# EasyEDA Pro project ProPrj_Business Card Macro Pad_2025-06-18.epro, schematic Business Card Macro Pad

## Sheets
1 MCU: Board Name: Board1; Create Date: 2025-04-06; Page Name: MCU; Project Name: Business Card Macro Pad; Schematic Name: Business Card Macro Pad; Update Date: 2025-04-10; Company: JFHCA; Drawn: Jaron O'Grady; Page Size: A3; Version: V1.0
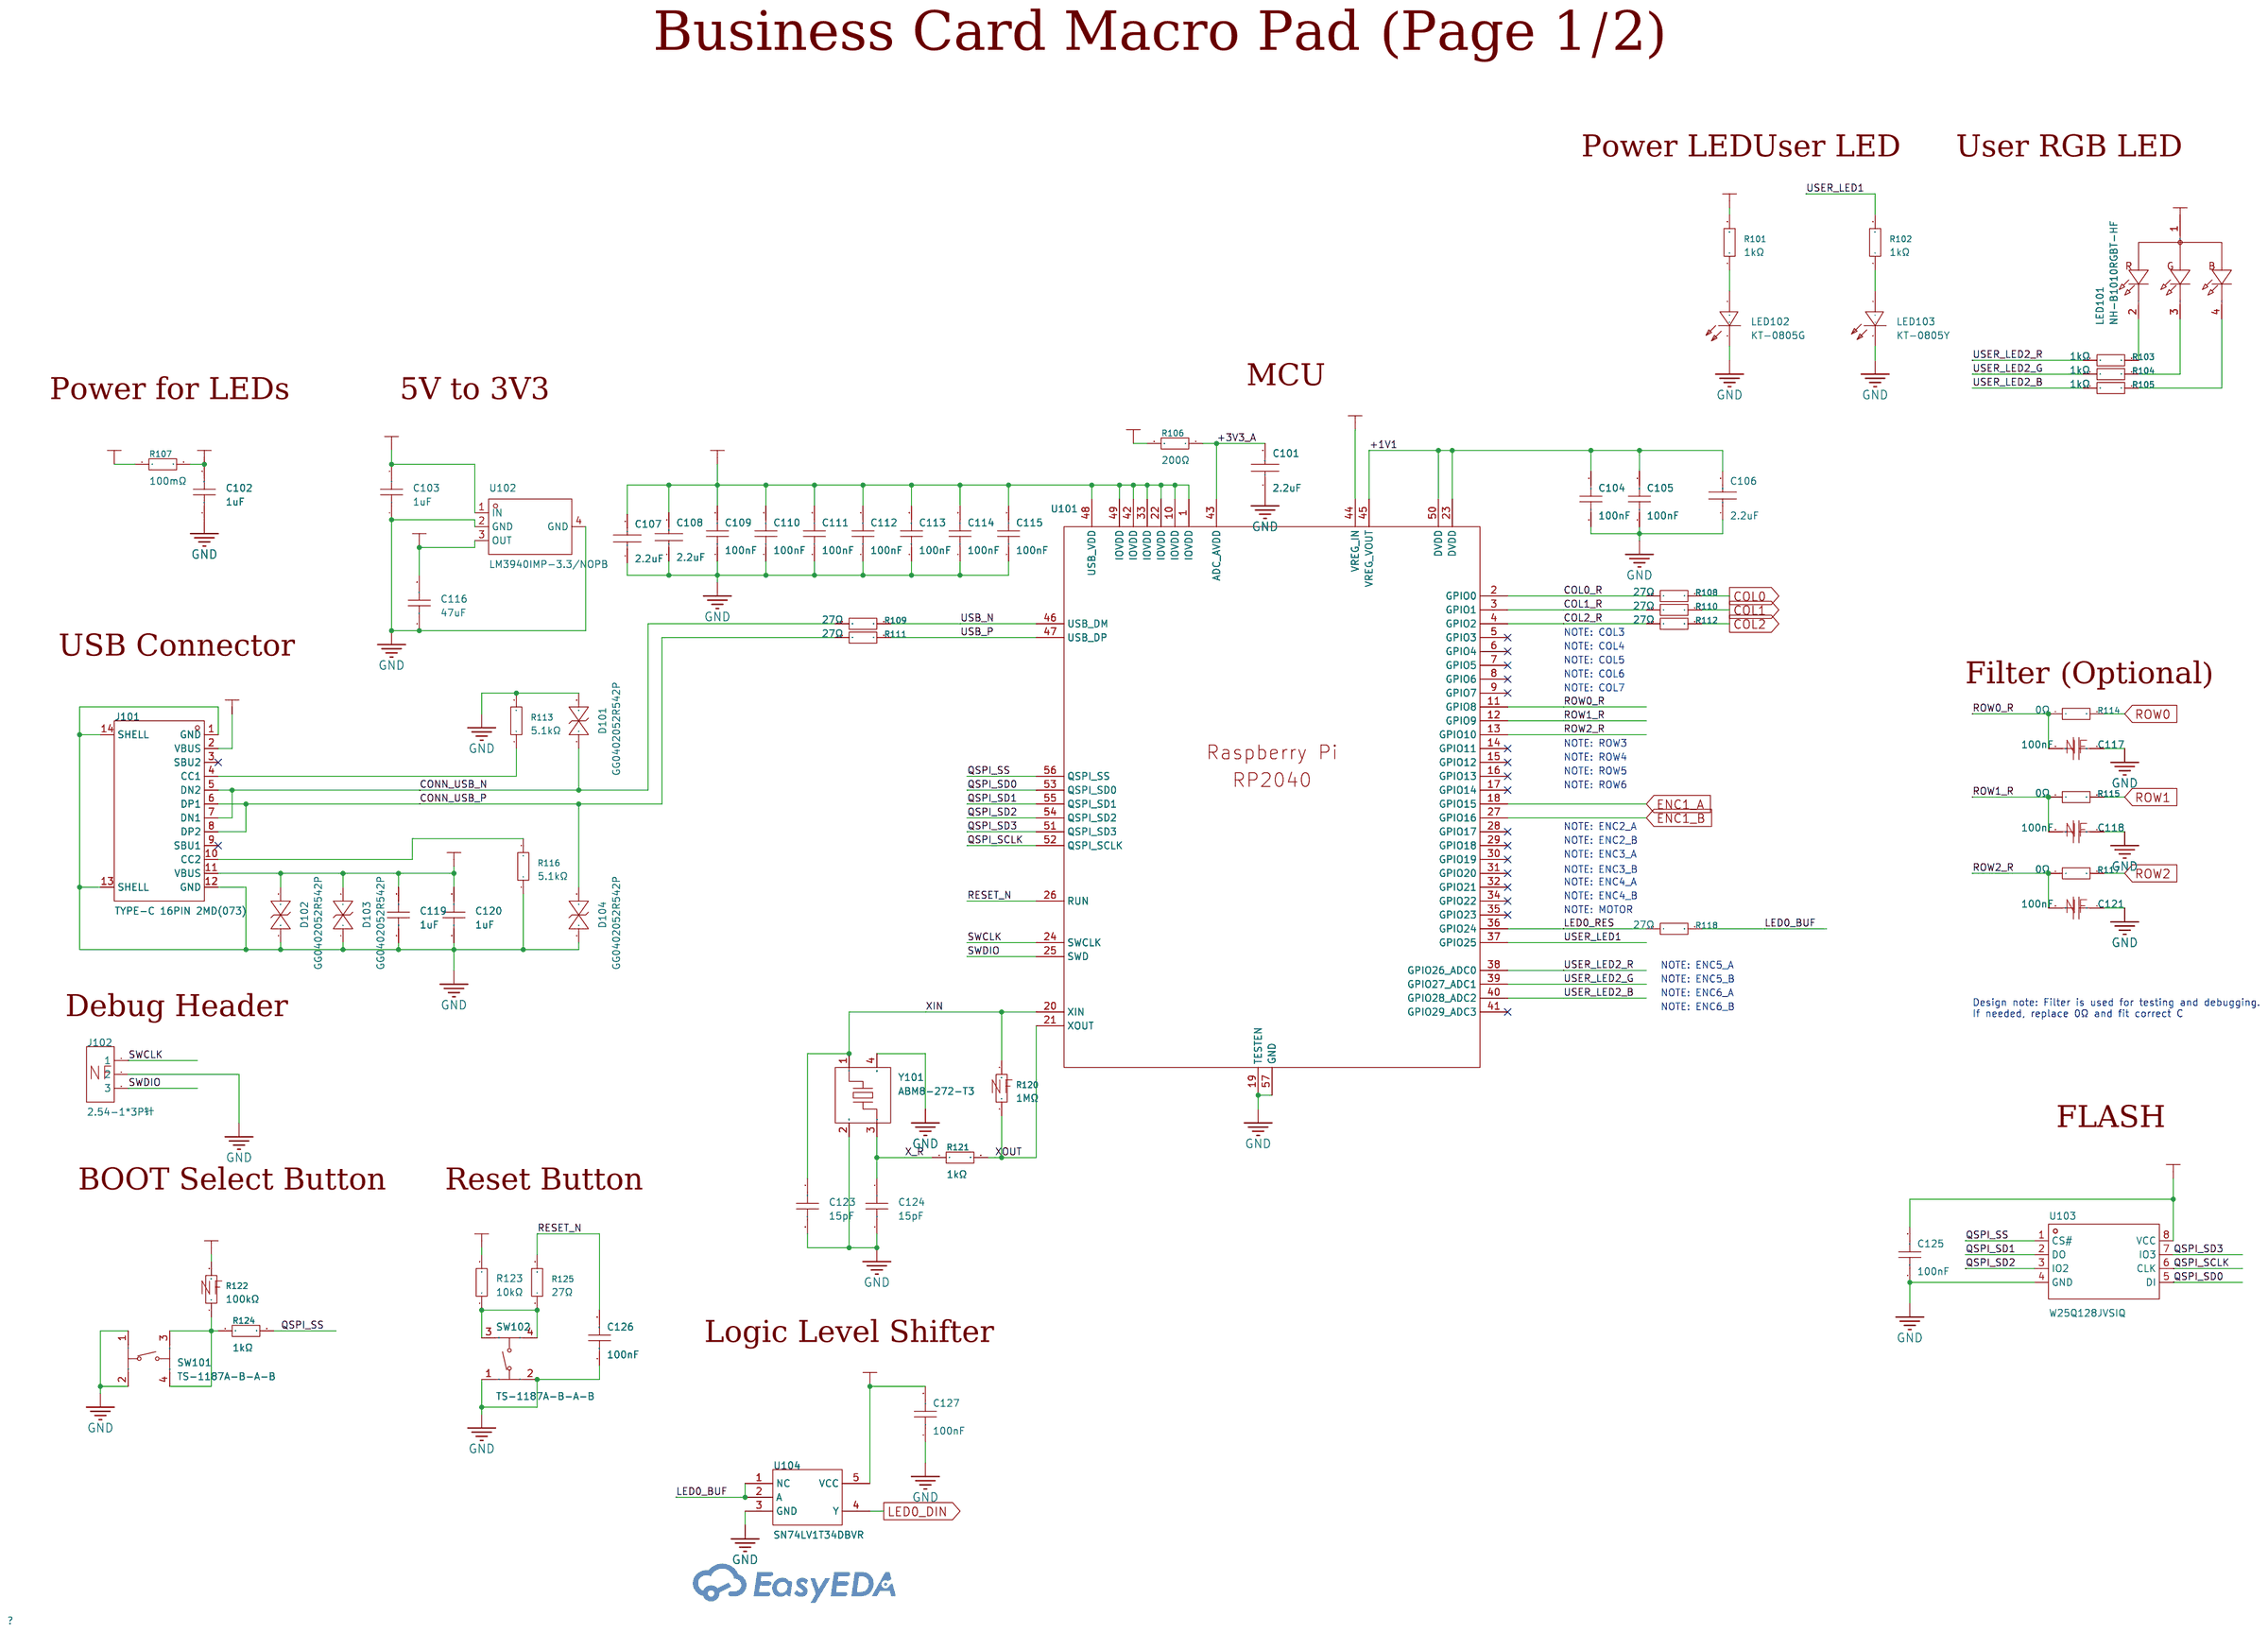
[diagram p0: MCU]
2 OTHER: Page Name: OTHER; Update Date: 2025-04-11
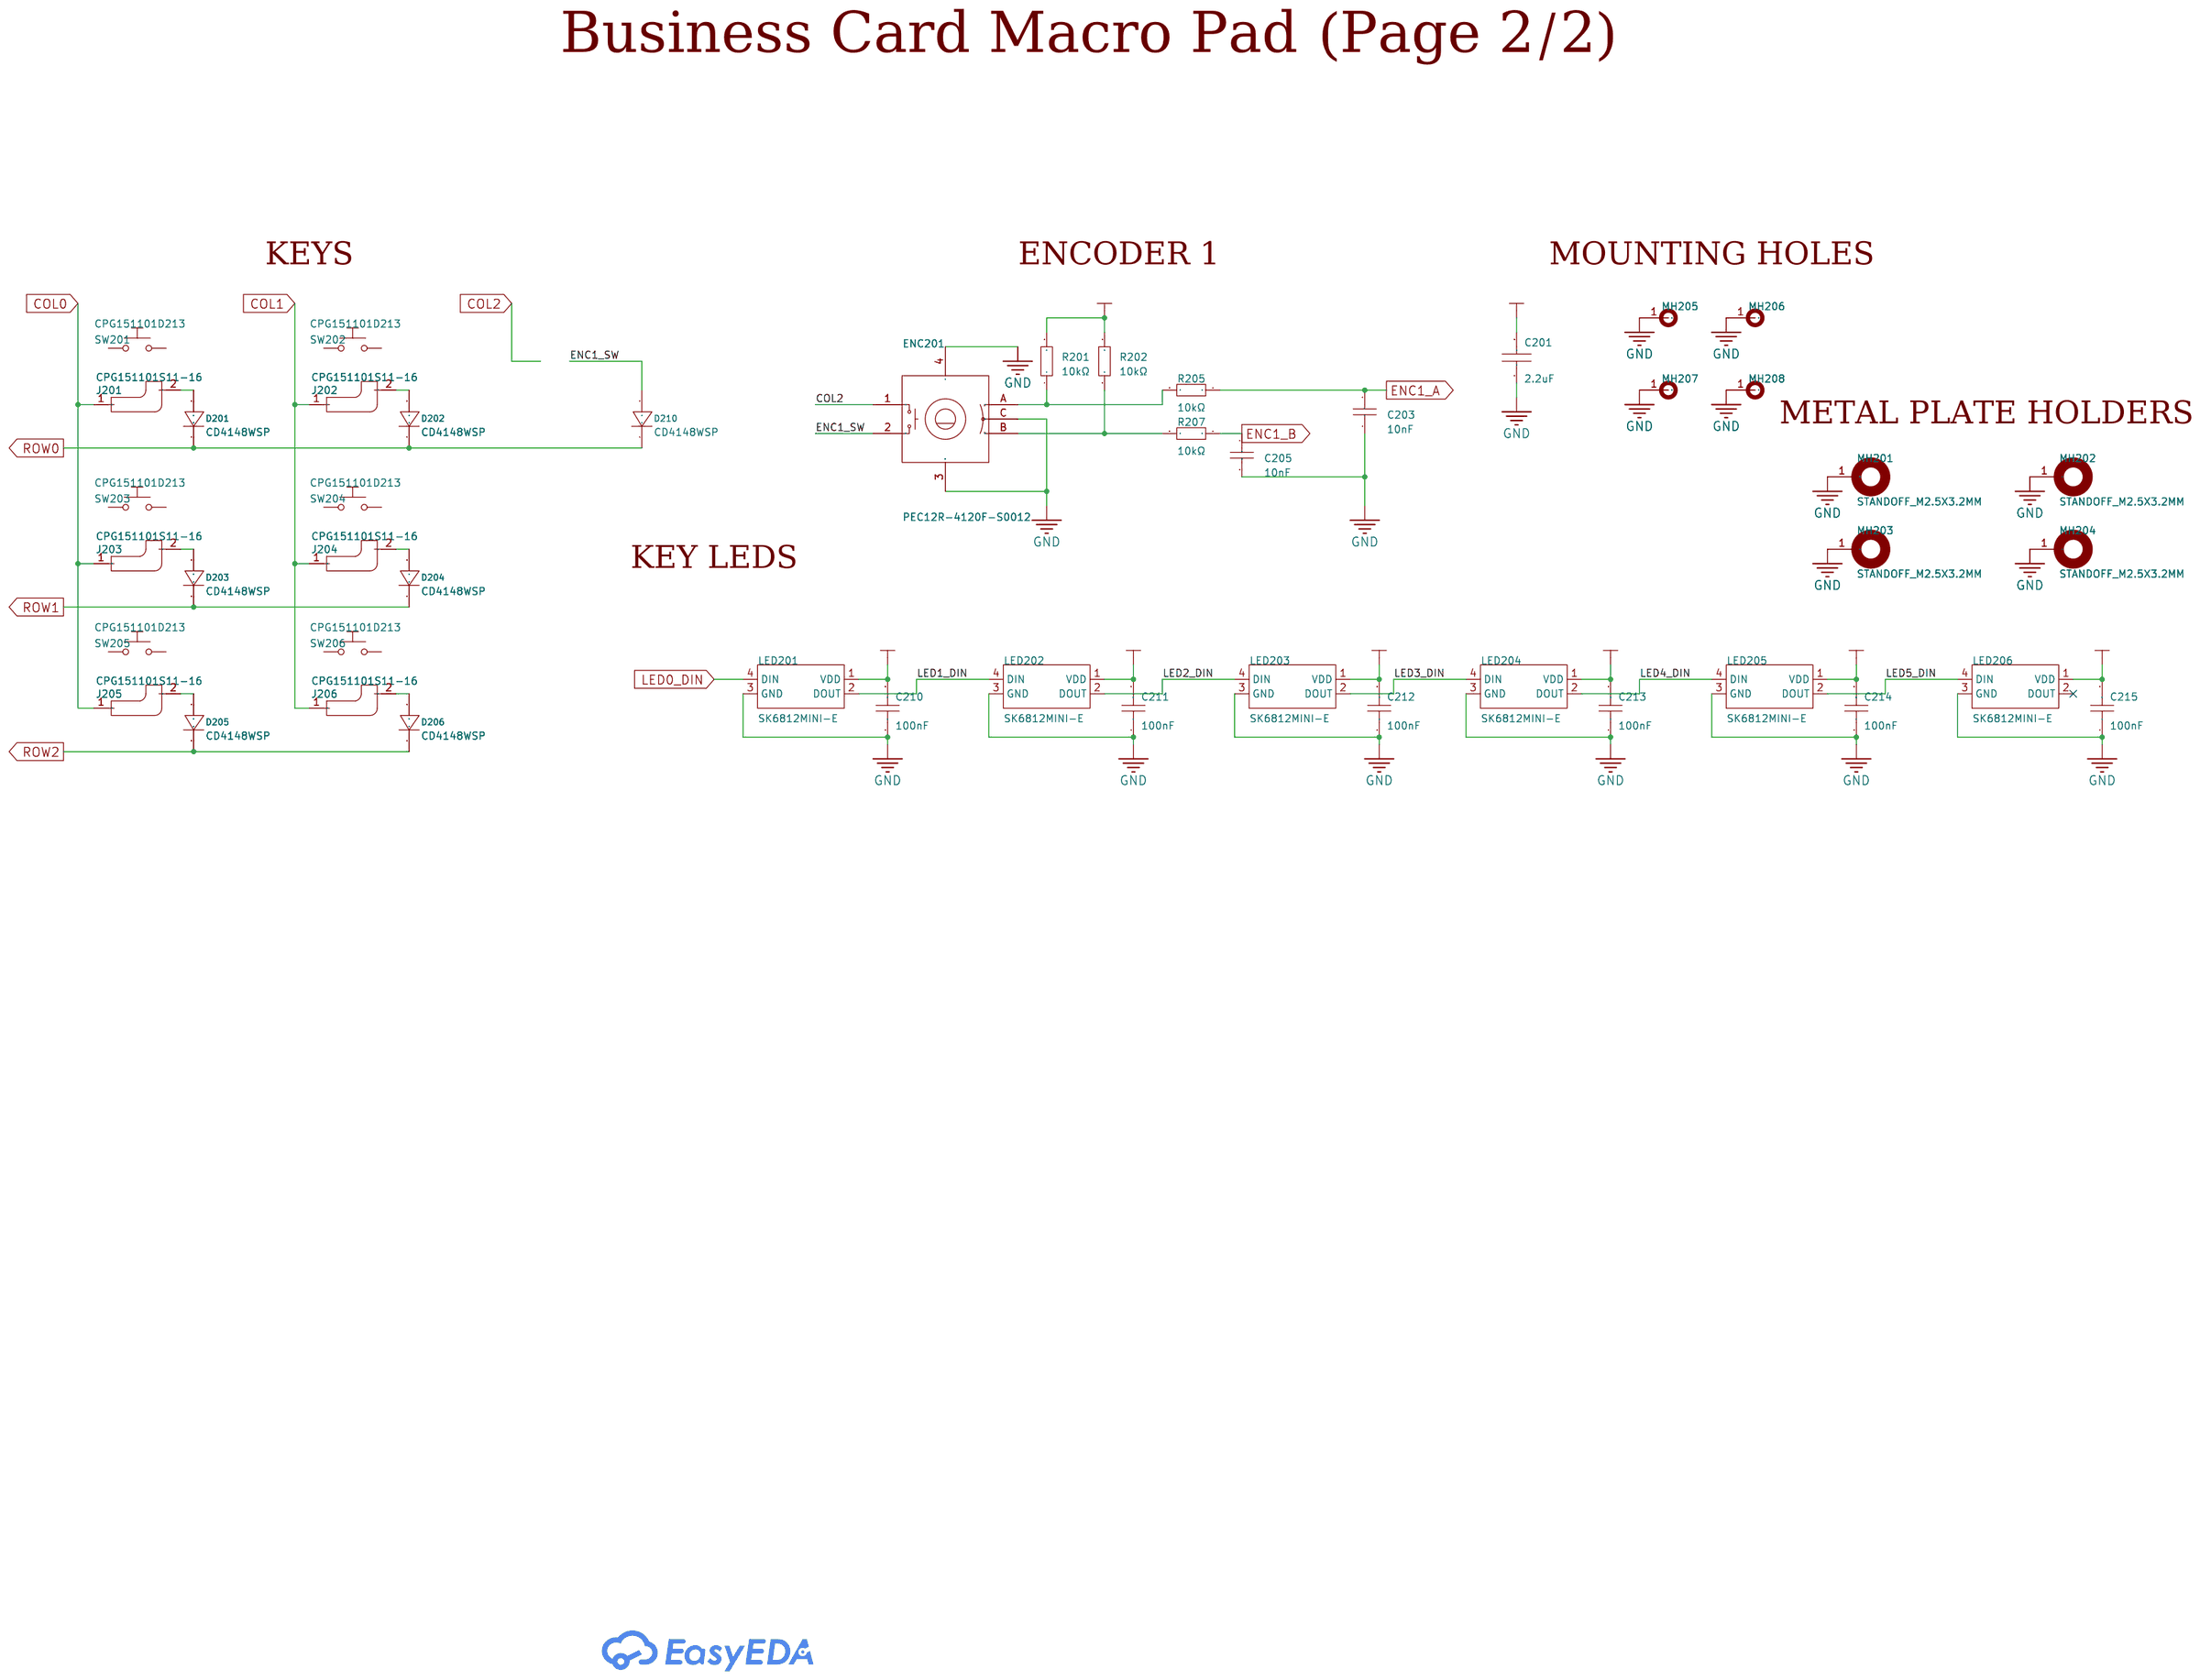
[diagram p1: OTHER]

## Parts
sheet MCU
C101  2.2uF  [C0402]
C102  1uF  [C0402]
C103  1uF  [C0402]
C104  100nF  [C0402]
C105  100nF  [C0402]
C106  2.2uF  [C0402]
C107  2.2uF  [C0402]
C108  2.2uF  [C0402]
C109  100nF  [C0402]
C110  100nF  [C0402]
C111  100nF  [C0402]
C112  100nF  [C0402]
C113  100nF  [C0402]
C114  100nF  [C0402]
C115  100nF  [C0402]
C116  47uF  [C1206]
C117  100nF  [C0402]  (no BOM)
C118  100nF  [C0402]  (no BOM)
C119  1uF  [C0402]
C120  1uF  [C0402]
C121  100nF  [C0402]  (no BOM)
C123  15pF  [C0402]
C124  15pF  [C0402]
C125  100nF  [C0402]
C126  100nF  [C0402]
C127  100nF  [C0402]
D101  GG0402052R542P  [D0402-BI]
D102  GG0402052R542P  [D0402-BI]
D103  GG0402052R542P  [D0402-BI]
D104  GG0402052R542P  [D0402-BI]
J101  TYPE-C 16PIN 2MD(073)  [USB-C-SMD_TYPE-C-6PIN-2MD-073]
J102  2.54-1*3P针  [HDR-TH_3P-P2.54-V-M-1]  (no BOM)
LED101  NH-B1010RGBT-HF  [LED-ARRAY-SMD_4P-L1.0-W1.0-TR_NH-B1010RGBT]
LED102  KT-0805G  [LED0805-R-RD]
LED103  KT-0805Y  [LED0805-R-RD]
R101  1kΩ  [R0402]
R102  1kΩ  [R0402]
R103  1kΩ  [R0402]
R104  1kΩ  [R0402]
R105  1kΩ  [R0402]
R106  200Ω  [R0402]
R107  100mΩ  [R1206]
R108  27Ω  [R0402]
R109  27Ω  [R0402]
R110  27Ω  [R0402]
R111  27Ω  [R0402]
R112  27Ω  [R0402]
R113  5.1kΩ  [R0402]
R114  0Ω  [R0402]
R115  0Ω  [R0402]
R116  5.1kΩ  [R0402]
R117  0Ω  [R0402]
R118  27Ω  [R0402]
R120  1MΩ  [R0402]  (no BOM)
R121  1kΩ  [R0402]
R122  100kΩ  [R0402]  (no BOM)
R123  10kΩ  [R0402]
R124  1kΩ  [R0402]
R125  27Ω  [R0402]
SW101  TS-1187A-B-A-B  [SW-SMD_4P-L5.1-W5.1-P3.70-LS6.5-TL_H1.5]
SW102  TS-1187A-B-A-B  [SW-SMD_4P-L5.1-W5.1-P3.70-LS6.5-TL_H1.5]
U101  RP2040  [LQFN-56_L7.0-W7.0-P0.4-EP]
U102  LM3940IMP-3.3/NOPB  [SOT-223_L6.5-W3.5-P2.30-LS7.0-BR]
U103  W25Q128JVSIQ  [SOIC-8_L5.3-W5.3-P1.27-LS8.0-BL]
U104  SN74LV1T34DBVR  [SOT-23-5_L2.9-W1.6-P0.95-LS2.8-BR]
Y101  ABM8-272-T3  [CRYSTAL-SMD_4P-L3.2-W2.5-BL]
sheet OTHER
C201  2.2uF  [C0402]
C203  10nF  [C0402]
C205  10nF  [C0402]
C210  100nF  [C0402]
C211  100nF  [C0402]
C212  100nF  [C0402]
C213  100nF  [C0402]
C214  100nF  [C0402]
C215  100nF  [C0402]
D201  CD4148WSP  [D0805-RD]
D202  CD4148WSP  [D0805-RD]
D203  CD4148WSP  [D0805-RD]
D204  CD4148WSP  [D0805-RD]
D205  CD4148WSP  [D0805-RD]
D206  CD4148WSP  [D0805-RD]
D210  CD4148WSP  [D0805-RD]
ENC201  PEC12R-4120F-S0012  [SW-TH_PEC12R-4120F-S0012]
J201  CPG151101S11-16  [SMD_KEYBOARD-SW]
J202  CPG151101S11-16  [SMD_KEYBOARD-SW]
J203  CPG151101S11-16  [SMD_KEYBOARD-SW]
J204  CPG151101S11-16  [SMD_KEYBOARD-SW]
J205  CPG151101S11-16  [SMD_KEYBOARD-SW]
J206  CPG151101S11-16  [SMD_KEYBOARD-SW]
LED201  SK6812MINI-E  [LED-SMD_L3.2-W2.8-LS5.9_SK6812MINI-E]
LED202  SK6812MINI-E  [LED-SMD_L3.2-W2.8-LS5.9_SK6812MINI-E]
LED203  SK6812MINI-E  [LED-SMD_L3.2-W2.8-LS5.9_SK6812MINI-E]
LED204  SK6812MINI-E  [LED-SMD_L3.2-W2.8-LS5.9_SK6812MINI-E]
LED205  SK6812MINI-E  [LED-SMD_L3.2-W2.8-LS5.9_SK6812MINI-E]
LED206  SK6812MINI-E  [LED-SMD_L3.2-W2.8-LS5.9_SK6812MINI-E]
MH201  STANDOFF_M2.5X3.2MM  [STANDOFF_M2.5X3.5MM_JO_v1.0]
MH202  STANDOFF_M2.5X3.2MM  [STANDOFF_M2.5X3.5MM_JO_v1.0]
MH203  STANDOFF_M2.5X3.2MM  [STANDOFF_M2.5X3.5MM_JO_v1.0]
MH204  STANDOFF_M2.5X3.2MM  [STANDOFF_M2.5X3.5MM_JO_v1.0]
MH205  -  [MH_7.5X3.2MM_JO_v1.0]  (no BOM)
MH206  -  [MH_7.5X3.2MM_JO_v1.0]  (no BOM)
MH207  -  [MH_7.5X3.2MM_JO_v1.0]  (no BOM)
MH208  -  [MH_7.5X3.2MM_JO_v1.0]  (no BOM)
R201  10kΩ  [R0402]
R202  10kΩ  [R0402]
R205  10kΩ  [R0402]
R207  10kΩ  [R0402]
SW201  CPG151101D213  [KEY-TH_CPG151101D21X]
SW202  CPG151101D213  [KEY-TH_CPG151101D21X]
SW203  CPG151101D213  [KEY-TH_CPG151101D21X]
SW204  CPG151101D213  [KEY-TH_CPG151101D21X]
SW205  CPG151101D213  [KEY-TH_CPG151101D21X]
SW206  CPG151101D213  [KEY-TH_CPG151101D21X]

## Library data of the parts
C101 C106-C108 C201 = CL05A225MQ5NSNC: Capacitance: Tolerance:±20% Tolerance:±20% Voltage Rated: Temperature Coefficient:; LCSC Part Name: 2.2uF ±20% 6.3V; Supplier Part: C12530; Manufacturer: SAMSUNG(三星); Supplier Footprint: 0402; JLCPCB Part Class: Basic Part; Datasheet: https://atta.szlcsc.com/upload/public/pdf/source/20160218/1457707763339.pdf; Supplier: LCSC; Tolerance: ±20%
C102 C103 C119 C120 = CL05A105KA5NQNC: Capacitance: Tolerance:±10% Tolerance:±10% Voltage Rated: Temperature Coefficient:; LCSC Part Name: 1uF ±10% 25V; Supplier Part: C52923; Manufacturer: SAMSUNG(三星); Supplier Footprint: 0402; JLCPCB Part Class: Basic Part; Datasheet: https://atta.szlcsc.com/upload/public/pdf/source/20160218/1457707763339.pdf; Supplier: LCSC; Tolerance: ±10%
C104 C105 C109-C115 C117 C118 C121 C125-C127 C210-C215 = CL05B104KO5NNNC: Capacitance: Tolerance:±10% Tolerance:±10% Voltage Rated: Temperature Coefficient:; LCSC Part Name: 100nF ±10% 16V; Supplier Part: C1525; Manufacturer: SAMSUNG(三星); Supplier Footprint: 0402; JLCPCB Part Class: Basic Part; Datasheet: https://atta.szlcsc.com/upload/public/pdf/source/20160218/1457707763339.pdf; Supplier: LCSC; Tolerance: ±10%
C116 = CL31A476MPHNNNE: Capacitance: Tolerance:±20% Tolerance:±20% Voltage Rated: Temperature Coefficient:; LCSC Part Name: 47uF ±20% 10V; Supplier Part: C96123; Manufacturer: SAMSUNG(三星); Supplier Footprint: 1206; JLCPCB Part Class: Basic Part; Datasheet: https://atta.szlcsc.com/upload/public/pdf/source/20160218/1457707763339.pdf; Supplier: LCSC; Tolerance: ±20%
C123 C124 = CL05C150JB5NNNC: Capacitance: Tolerance:±5% Tolerance:±5% Voltage Rated: Temperature Coefficient:; LCSC Part Name: 15pF ±5% 50V; Supplier Part: C86285; Manufacturer: SAMSUNG(三星); Supplier Footprint: 0402; JLCPCB Part Class: Extended Part; Datasheet: https://atta.szlcsc.com/upload/public/pdf/source/20160218/1457707763339.pdf; Supplier: LCSC; Tolerance: ±5%
D101-D104 = GG0402052R542P: Reverse Stand-Off Voltage (Vrwm):5V Maximum Clamping Voltage:15.5V Peak Pulse Current (Ipp):3A@8/20us Peak Pulse Power Dissipation (Ppp):46W Breakdown Voltage:5.5V Type:TVS; LCSC Part Name: TVS 5V截止 3A峰值脉冲; Supplier Part: C1973257; Manufacturer: Kyocera AVX; Supplier Footprint: 0402; JLCPCB Part Class: Extended Part; Datasheet: https://atta.szlcsc.com/upload/public/pdf/source/20230915/02C5CA4E262376923D9117899A14A9C6.pdf; Supplier: LCSC; Reverse Stand-Off Voltage (Vrwm): 5V; Maximum Clamping Voltage: 15.5V; Peak Pulse Current (Ipp): 3A@8/20us; Peak Pulse Power Dissipation (Ppp): 46W; Breakdown Voltage: 5.5V; Type: TVS
J101 = TYPE-C 16PIN 2MD(073): Connector Type:Type-C Standard:USB 3.1 Gender:Female Mounting Style:Horizontal attachment Number of Contacts:16P Number of Ports:1 Current Rating - Power (Max):5A Operating Temperature Range:-25℃~+85℃ Operating Temperature Range:-25℃~+85℃ Rated Voltage (M; LCSC Part Name: Type-C 母 卧贴; Supplier Part: C2765186; Manufacturer: SHOU HAN(首韩); Supplier Footprint: SMD; JLCPCB Part Class: Extended Part; Datasheet: https://atta.szlcsc.com/upload/public/pdf/source/20211123/39B17C16241EAC15C5E277BDA434118E.pdf; Supplier: LCSC; Connector Type: Type-C; Standard: USB 3.1; Gender: Female; Mounting Style: Horizontal attachment; Number of Contacts: 16P; Number of Ports: 1; Current Rating - Power (Max): 5A; Operating Temperature Range: -25℃~+85℃; Rated Voltage (Max): 5V; Connect-Disconnect Life: 5000 Cuts; Core Colour: Black
J102 = 2.54-1*3P针: Pin Structure:1x3P Pitch:2.54mm Row Spacing:- Circluar Pins/Square Pins:Policy Mounting Type:Direct Insert Number of Rows:Single Row Number of Pins:3P Current Rating (Max):3A Voltage Rating (Max):- Length of Mating Pin:- Insulation Height:- Length of End; LCSC Part Name: 间距:2.54mm 1x3P 直插 方针; Supplier Part: C49257; Manufacturer: BOOMELE(博穆精密); Supplier Footprint: 插件,P=2.54mm; JLCPCB Part Class: Extended Part; Datasheet: https://atta.szlcsc.com/upload/public/pdf/source/20221018/3E9408392E35E6F57A28985E5F7BF5C9.pdf; Supplier: LCSC; Pin Structure: 1x3P; Pitch: 2.54mm; Circluar Pins/Square Pins: Policy; Mounting Type: Direct Insert; Number of Rows: Single Row; Number of Pins: 3P; Current Rating (Max): 3A; Operating Temperature Range: -40℃~+105℃; Color: Black
LED101 = NH-B1010RGBT-HF_JO_v1.0: Diode Configuration:Common Anode Dominant Wavelength:R:620nm；G:530nm；B:470nm Luminous Intensity:R:18mcd；G:25mcd；B:4.5mcd Viewing Angle:120° Forward Current:B:2mA；G:2mA；R:5mA Forward Voltage:R:2V；G:2.6V；B:2.7V Installation Method:Positive Stick Operating T; Supplier Part: C2874113; Manufacturer: 国星光电; Supplier Footprint: SMD-4P,1x1mm; Datasheet: https://atta.szlcsc.com/upload/public/pdf/source/20210810/0B2E174735C36A18A5A2783CB3D0373F.pdf; Supplier: LCSC; Diode Configuration: Common Anode; Dominant Wavelength: R:620nm；G:530nm；B:470nm; Luminous Intensity: R:18mcd；G:25mcd；B:4.5mcd; Viewing Angle: 120°; Forward Current: B:2mA；G:2mA；R:5mA; Forward Voltage: R:2V；G:2.6V；B:2.7V; Installation Method: Positive Stick; Operating Temperature: -30℃~+85℃
LED102 = KT-0805G: Lamp Holder Type:- Emitted Color:Emerald Forward Voltage (VF):- Forward Voltage (VF):- Power Dissipation:- Forward Current:- Dominant Wavelength:- Dominant Wavelength:- Peak Wavelength:- Diode Configuration:- Lens Color:- Color Temperature:- Color Tempera; LCSC Part Name: 0805 翠绿 高亮; Supplier Part: C2297; Manufacturer: KENTO; Supplier Footprint: 0805; JLCPCB Part Class: Basic Part; Datasheet: https://atta.szlcsc.com/upload/public/pdf/source/20170209/1486607340485.pdf; Supplier: LCSC; Emitted Color: Emerald
LED103 = KT-0805Y: Emitted Color:Yellow Power Dissipation:- Forward Current:- Dominant Wavelength:- Dominant Wavelength:- Peak Wavelength:- Diode Configuration:- Lens Color:- Color Temperature:- Color Temperature:- Viewing Angle:- Mounting Sytle:- Operating Temperature:- Op; LCSC Part Name: 0805 黄灯 高亮; Supplier Part: C2296; Manufacturer: KENTO; Supplier Footprint: 0805; JLCPCB Part Class: Basic Part; Datasheet: https://atta.szlcsc.com/upload/public/pdf/source/20160421/1461205044170.pdf; Supplier: LCSC; Emitted Color: Yellow
R101-R105 R121 R124 = 0402WGF1001TCE: Type:Thick Film Resistors Resistance:1kΩ Tolerance:±1% Tolerance:±1% Power(Watts): Overload Voltage (Max): Temperature Coefficient:±100ppm/℃ Temperature Coefficient:±100ppm/℃ Operating Temperature Range:-55℃~+155℃ Operating Temperature Range:-55℃~+155℃; LCSC Part Name: 1kΩ ±1% 62.5mW 厚膜电阻; Supplier Part: C11702; Manufacturer: UNI-ROYAL(厚声); Supplier Footprint: 0402; JLCPCB Part Class: Basic Part; Datasheet: https://atta.szlcsc.com/upload/public/pdf/source/20200306/C422600_1E6D84923E4A46A82E41ADD87F860B5C.pdf; Supplier: LCSC; Type: Thick Film Resistors; Tolerance: ±1%; Temperature Coefficient: ±100ppm/℃; Operating Temperature Range: -55℃~+155℃
R106 = 0402WGF2000TCE: Type:Thick Film Resistors Resistance: Tolerance:±1% Tolerance:±1% Power(Watts): Overload Voltage (Max): Temperature Coefficient:±100ppm/℃ Temperature Coefficient:±100ppm/℃ Operating Temperature Range:-55℃~+155℃ Operating Temperature Range:-55℃~+155℃; LCSC Part Name: 200Ω ±1% 62.5mW 厚膜电阻; Supplier Part: C25087; Manufacturer: UNI-ROYAL(厚声); Supplier Footprint: 0402; JLCPCB Part Class: Basic Part; Datasheet: https://atta.szlcsc.com/upload/public/pdf/source/20200306/C422600_1E6D84923E4A46A82E41ADD87F860B5C.pdf; Supplier: LCSC; Type: Thick Film Resistors; Tolerance: ±1%; Temperature Coefficient: ±100ppm/℃; Operating Temperature Range: -55℃~+155℃
R107 = 1206W4F100LT5E: Type:Thick Film Resistors Resistance:100mΩ Tolerance:±1% Tolerance:±1% Power(Watts): Overload Voltage (Max): Temperature Coefficient:±800ppm/℃ Temperature Coefficient:±800ppm/℃ Operating Temperature Range:-55℃~+155℃ Operating Temperature Range:-55℃~+155℃; LCSC Part Name: 100mΩ ±1% 250mW 厚膜电阻; Supplier Part: C25334; Manufacturer: UNI-ROYAL(厚声); Supplier Footprint: 1206; JLCPCB Part Class: Basic Part; Datasheet: https://atta.szlcsc.com/upload/public/pdf/source/20200306/C422600_1E6D84923E4A46A82E41ADD87F860B5C.pdf; Supplier: LCSC; Type: Thick Film Resistors; Tolerance: ±1%; Temperature Coefficient: ±800ppm/℃; Operating Temperature Range: -55℃~+155℃
R108-R112 R118 R125 = 0402WGF270JTCE: Type:Thick Film Resistors Resistance:27Ω Tolerance:±1% Tolerance:±1% Power(Watts): Overload Voltage (Max): Temperature Coefficient:±100ppm/℃ Temperature Coefficient:±100ppm/℃ Operating Temperature Range:-55℃~+155℃ Operating Temperature Range:-55℃~+155℃; LCSC Part Name: 27Ω ±1% 62.5mW 厚膜电阻; Supplier Part: C25100; Manufacturer: UNI-ROYAL(厚声); Supplier Footprint: 0402; JLCPCB Part Class: Extended Part; Datasheet: https://atta.szlcsc.com/upload/public/pdf/source/20200306/C422600_1E6D84923E4A46A82E41ADD87F860B5C.pdf; Supplier: LCSC; Type: Thick Film Resistors; Tolerance: ±1%; Temperature Coefficient: ±100ppm/℃; Operating Temperature Range: -55℃~+155℃
R113 R116 = 0402WGF5101TCE: Type:Thick Film Resistors Resistance:5.1kΩ Tolerance:±1% Tolerance:±1% Power(Watts): Overload Voltage (Max): Temperature Coefficient:±100ppm/℃ Temperature Coefficient:±100ppm/℃ Operating Temperature Range:-55℃~+155℃ Operating Temperature Range:-55℃~+155℃; LCSC Part Name: 5.1kΩ ±1% 62.5mW 厚膜电阻; Supplier Part: C25905; Manufacturer: UNI-ROYAL(厚声); Supplier Footprint: 0402; JLCPCB Part Class: Basic Part; Datasheet: https://atta.szlcsc.com/upload/public/pdf/source/20200306/C422600_1E6D84923E4A46A82E41ADD87F860B5C.pdf; Supplier: LCSC; Type: Thick Film Resistors; Tolerance: ±1%; Temperature Coefficient: ±100ppm/℃; Operating Temperature Range: -55℃~+155℃
R114 R115 R117 = 0402WGF0000TCE: Type:Thick Film Resistors Resistance: Tolerance:±1% Tolerance:±1% Power(Watts): Overload Voltage (Max): Temperature Coefficient:±800ppm/℃ Temperature Coefficient:±800ppm/℃ Operating Temperature Range:-55℃~+155℃ Operating Temperature Range:-55℃~+155℃; LCSC Part Name: 0Ω ±1% 62.5mW 厚膜电阻; Supplier Part: C17168; Manufacturer: UNI-ROYAL(厚声); Supplier Footprint: 0402; JLCPCB Part Class: Basic Part; Datasheet: https://atta.szlcsc.com/upload/public/pdf/source/20200306/C422600_1E6D84923E4A46A82E41ADD87F860B5C.pdf; Supplier: LCSC; Type: Thick Film Resistors; Tolerance: ±1%; Temperature Coefficient: ±800ppm/℃; Operating Temperature Range: -55℃~+155℃
R120 = 0402WGF1004TCE: Type:Thick Film Resistors Resistance:1MΩ Tolerance:±1% Tolerance:±1% Power(Watts): Overload Voltage (Max): Temperature Coefficient:±100ppm/℃ Temperature Coefficient:±100ppm/℃ Operating Temperature Range:-55℃~+155℃ Operating Temperature Range:-55℃~+155℃; LCSC Part Name: 1MΩ ±1% 62.5mW 厚膜电阻; Supplier Part: C26083; Manufacturer: UNI-ROYAL(厚声); Supplier Footprint: 0402; JLCPCB Part Class: Basic Part; Datasheet: https://atta.szlcsc.com/upload/public/pdf/source/20200306/C422600_1E6D84923E4A46A82E41ADD87F860B5C.pdf; Supplier: LCSC; Type: Thick Film Resistors; Tolerance: ±1%; Temperature Coefficient: ±100ppm/℃; Operating Temperature Range: -55℃~+155℃
R122 = 0402WGF1003TCE: Type:Thick Film Resistors Resistance:100kΩ Tolerance:±1% Tolerance:±1% Power(Watts): Overload Voltage (Max): Temperature Coefficient:±100ppm/℃ Temperature Coefficient:±100ppm/℃ Operating Temperature Range:-55℃~+155℃ Operating Temperature Range:-55℃~+155℃; LCSC Part Name: 100kΩ ±1% 62.5mW 厚膜电阻; Supplier Part: C25741; Manufacturer: UNI-ROYAL(厚声); Supplier Footprint: 0402; JLCPCB Part Class: Basic Part; Datasheet: https://atta.szlcsc.com/upload/public/pdf/source/20200306/C422600_1E6D84923E4A46A82E41ADD87F860B5C.pdf; Supplier: LCSC; Type: Thick Film Resistors; Tolerance: ±1%; Temperature Coefficient: ±100ppm/℃; Operating Temperature Range: -55℃~+155℃
R123 R201 R202 R205 R207 = 0402WGF1002TCE: Type:Thick Film Resistors Resistance:10kΩ Tolerance:±1% Tolerance:±1% Power(Watts): Overload Voltage (Max): Temperature Coefficient:±100ppm/℃ Temperature Coefficient:±100ppm/℃ Operating Temperature Range:-55℃~+155℃ Operating Temperature Range:-55℃~+155℃; LCSC Part Name: 10kΩ ±1% 62.5mW 厚膜电阻; Supplier Part: C25744; Manufacturer: UNI-ROYAL(厚声); Supplier Footprint: 0402; JLCPCB Part Class: Basic Part; Datasheet: https://atta.szlcsc.com/upload/public/pdf/source/20200306/C422600_1E6D84923E4A46A82E41ADD87F860B5C.pdf; Supplier: LCSC; Type: Thick Film Resistors; Tolerance: ±1%; Temperature Coefficient: ±100ppm/℃; Operating Temperature Range: -55℃~+155℃
SW101 SW102 = TS-1187A-B-A-B: Circuit:SPST Actuator Style:Round Button Operating Force:160gf Mounting Style:Brick nogging Switch Length:5.1mm Switch Width:5.1mm Switch Height:1.5mm Strike Gundam:不带 Contact Current:50mA Voltage Rating (DC):12V Insulation Resistance:- Actuator/Cap Color; LCSC Part Name: 5.1*5.1*1.5mm 立贴 轻触开关; Supplier Part: C318884; Manufacturer: XKB Connectivity(中国星坤); Supplier Footprint: SMD; JLCPCB Part Class: Basic Part; Datasheet: https://atta.szlcsc.com/upload/public/pdf/source/20200227/C318890_053E50208A88A7BA1965D8746000774E.pdf; Supplier: LCSC; Circuit: SPST; Actuator Style: Round Button; Operating Force: 160gf; Mounting Style: Brick nogging; Switch Length: 5.1mm; Switch Width: 5.1mm; Switch Height: 1.5mm; Strike Gundam: 不带; Contact Current: 50mA; Voltage Rating (DC): 12V; Actuator/Cap Color: 金色; With Lamp: No; Mechanical Life: 10万次; Operating Temperature: -30℃~+85℃
U101 = RP2040_C2040_jo_v1.0: CPU Core:- RAM Size:264KB GPIO Ports Number:30 Operating Voltage Range:- Operating Voltage Range:- CPU Maximum Speed:133MHz Program Memory Type:- Operating Temperature Range:- Operating Temperature Range:- ADC (Bit):12bit DAC (Bit):- PWM (Bit):- 8Bit Time; LCSC Part Name: RP2040（RP2B2）; Supplier Part: C2040; Manufacturer: Raspberry Pi(树莓派); Supplier Footprint: LQFN-56(7x7); Datasheet: https://atta.szlcsc.com/upload/public/pdf/source/20210621/C2040_96F425825606B7957D87DD32E2512CA9.pdf; Supplier: LCSC; RAM Size: 264KB; GPIO Ports Number: 30; CPU Maximum Speed: 133MHz; ADC (Bit): 12bit; UART/USART: 2; I2C: 2; SPI: 2; Universal Serial Bus: 有; Peripheral/Function: DMA；PWM; Direct Memory Access: 有
U102 = LM3940IMP-3.3/NOPB: Output Type:Fixed Maximum Input Voltage:7.5V Output Voltage:3.3V Output Voltage:3.3V Output Current:1A Power Supply Rejection Ratio (PSRR):- Dropout Voltage:200mV@(100mA) Feature:防静电保护；Short-Circuit  Protection；低ESR；Thermal Protection(TSD)；Overcurrent Pro; LCSC Part Name: 用于 5V 至 3.3V 电压转换的 1A 低压降稳压器; Supplier Part: C140319; Manufacturer: TI(德州仪器); Supplier Footprint: SOT-223; JLCPCB Part Class: Extended Part; Datasheet: https://www.ti.com/cn/lit/gpn/lm3940; Supplier: LCSC; Output Type: Fixed; Maximum Input Voltage: 7.5V; Output Voltage: 3.3V; Output Current: 1A; Dropout Voltage: 200mV@(100mA); Feature: 防静电保护；Short-Circuit  Protection；低ESR；Thermal Protection(TSD)；Overcurrent Protection(OCP)；带使能; Operating Temperature: -40℃~+125℃; Output Polarity: Positive electrode; Number of Outputs: 1
U103 = W25Q128JVSIQ: Interface Type:SPI Memory Size:128Mbit Clock Frequency (fc):133MHz Supply Voltage:2.7V~3.6V Supply Voltage:2.7V~3.6V Page Programming Time (Tpp):700us Block Erase Time (tBE):120ms@(32KB) Data Retention - TDR (Year):20 years Operating Temperature:-40℃~+85℃; LCSC Part Name: W25Q128JVSIQ 编带; Supplier Part: C97521; Manufacturer: WINBOND(华邦); Supplier Footprint: SOIC-8-208mil; JLCPCB Part Class: Basic Part; Datasheet: https://atta.szlcsc.com/upload/public/pdf/source/20170316/1489627409956.pdf; Supplier: LCSC; Interface Type: SPI; Memory Size: 128Mbit; Clock Frequency (fc): 133MHz; Supply Voltage: 2.7V~3.6V; Page Programming Time (Tpp): 700us; Block Erase Time (tBE): 120ms@(32KB); Data Retention - TDR (Year): 20 years; Operating Temperature: -40℃~+85℃
U104 = SN74LV1T34DBVR_JO_v1.0: Input type:- output type:推挽 Supply Voltage:1.6V~5.5V Supply Voltage:1.6V~5.5V Number of Elements:1 Number of Bits per Element:1 Sink Current:8mA Source Current:8mA Logic Family:74LV Operating Temperature:-40℃~+125℃ Operating Temperature:-40℃~+125℃; Supplier Part: C100024; Manufacturer: TI(德州仪器); Supplier Footprint: SOT-23-5; Datasheet: https://www.ti.com/cn/lit/gpn/sn74lv1t34; Supplier: LCSC; output type: 推挽; Supply Voltage: 1.6V~5.5V; Number of Elements: 1; Number of Bits per Element: 1; Sink Current: 8mA; Source Current: 8mA; Logic Family: 74LV; Operating Temperature: -40℃~+125℃
Y101 = ABM8-272-T3_C20625731: Supplier Part: C20625731; Manufacturer: ABRACON; Supplier Footprint: SMD3225-4P; JLCPCB Part Class: Extended Part; Datasheet: https://atta.szlcsc.com/upload/public/pdf/source/20240227/A8BE43F636D80F75C9AF5C59EDF21E9A.pdf; Supplier: LCSC
C203 C205 = CL05B103KB5NNNC: Capacitance: Tolerance:±10% Tolerance:±10% Voltage Rated: Temperature Coefficient:; LCSC Part Name: 10nF ±10% 50V; Supplier Part: C15195; Manufacturer: SAMSUNG(三星); Supplier Footprint: 0402; JLCPCB Part Class: Basic Part; Datasheet: https://atta.szlcsc.com/upload/public/pdf/source/20160218/1457707763339.pdf; Supplier: LCSC; Tolerance: ±10%
D201-D206 D210 = CD4148WSP_C109001: Diode Configuration: Forward Voltage (Vf@If):1.25V@100mA Reverse Voltage (Vr): Average Rectified Current (Io): Power Dissipation: Reverse Leakage Current:5uA@75V Reverse Recovery Time (trr): Operating Temperature:- Operating Temperature:-; LCSC Part Name: 电压:75V 电流:150mA; Supplier Part: C109001; Manufacturer: LIZ(丽智电子); Supplier Footprint: 0805; JLCPCB Part Class: Extended Part; Datasheet: https://atta.szlcsc.com/upload/public/pdf/source/20170510/1494399695091.pdf; Supplier: LCSC; Forward Voltage (Vf@If): 1.25V@100mA; Reverse Leakage Current: 5uA@75V
ENC201 = PEC12R-4120F-S0012_JO_v1.0: Supplier Part: C143801; Manufacturer: BOURNS; Supplier Footprint: 插件; Datasheet: https://atta.szlcsc.com/upload/public/pdf/source/20220425/FDFEFF279D64F139C3201B9534523AD5.pdf; Supplier: LCSC
J201-J206 = CPG151101S11-16_JO_v1.0: Axis Type:- Operating Voltage:2V~12V Operating Voltage:2V~12V Pin:- Mechanical Life:- Operation Force:- Conduction Travel:- Total Travel:- Operating Temperature:- Operating Temperature:-; Supplier Part: C5156480; Manufacturer: Kailh(凯华); Datasheet: https://atta.szlcsc.com/upload/public/pdf/source/20220829/33DFC1A320A078D20879F2B21562B513.pdf; Supplier: LCSC; Operating Voltage: 2V~12V
LED201-LED206 = SK6812MINI-E_C5149201: Supplier Part: C5149201; Manufacturer: 欧思科光电; Supplier Footprint: SMD; JLCPCB Part Class: Extended Part; Datasheet: https://atta.szlcsc.com/upload/public/pdf/source/20240708/7577C013CD62BC7D192EAA1AF5B38052.pdf; Supplier: LCSC
MH201-MH204 = 9774035151R_JO_v1.0: Standoff, Steel, M2.5, Hex Female-Female, 3.5 mm, 4.9 mm; Manufacturer: WURTH ELEKTRONIK; Supplier: FARNELL; Supplier Part: 46AJ4353; Part Number: 9774035151R
MH205-MH208 = MH_JO_copy_of_RF1_V1.0
SW201-SW206 = CPG151101D213_JO_v1.0: Axis Type:Copper Shaft Operating Voltage:2V~12V Operating Voltage:2V~12V Pin:2 Mechanical Life:70 Million Times Operation Force:40gf@±10gf Conduction Travel:1.1mm Total Travel:3.5mm Operating Temperature:- Operating Temperature:-; LCSC Part Name: KS 铜轴; Supplier Part: C400235; Manufacturer: Kailh(凯华); Supplier Footprint: 插件; Datasheet: https://atta.szlcsc.com/upload/public/pdf/source/20190626/C400235_1F32910D92087EE12050FA10DC4645BC.pdf; Supplier: LCSC; Axis Type: Copper Shaft; Operating Voltage: 2V~12V; Pin: 2; Mechanical Life: 70 Million Times; Operation Force: 40gf@±10gf; Conduction Travel: 1.1mm; Total Travel: 3.5mm

## Nets
+1V1: C104.2 C105.2 C106.2 U101.23(DVDD) U101.45(VREG_VOUT) U101.50(DVDD)
+3V3: C107.2 C108.2 C109.2 C110.2 C111.2 C112.2 C113.2 C114.2 C115.2 C116.2 C125.2 C201.2 LED101.1(+) R101.2 R106.2 R122.2 R123.2 R201.2 R202.2 U101.1(IOVDD) U101.10(IOVDD) U101.22(IOVDD) U101.33(IOVDD) U101.42(IOVDD) U101.44(VREG_IN) U101.48(USB_VDD) U101.49(IOVDD) U102.3(OUT) U103.8(VCC)
+3V3_A: C101.2 R106.1 U101.43(ADC_AVDD)
+5V_LEDS: C102.2 C210.2 C211.2 C212.2 C213.2 C214.2 C215.2 LED201.1(VDD) LED202.1(VDD) LED203.1(VDD) LED204.1(VDD) LED205.1(VDD) LED206.1(VDD) R107.2
+5V_USB: C103.2 C119.2 C120.2 C127.2 D102.2 D103.2 J101.2(VBUS) J101.11(VBUS) R107.1 U102.1(IN) U104.5(VCC)
GND: C101.1 C102.1 C103.1 C104.1 C105.1 C106.1 C107.1 C108.1 C109.1 C110.1 C111.1 C112.1 C113.1 C114.1 C115.1 C116.1 C117.1 C118.1 C119.1 C120.1 C121.1 C123.2 C124.2 C125.1 C126.1 C127.1 C201.1 C203.1 C205.1 C210.1 C211.1 C212.1 C213.1 C214.1 C215.1 D101.2 D102.1 D103.1 D104.1 ENC201.3 ENC201.4 ENC201.C J101.1(GND) J101.12(GND) J101.13(SHELL) J101.14(SHELL) J102.2 LED102.2(K) LED103.2(-) LED201.3(GND) LED202.3(GND) LED203.3(GND) LED204.3(GND) LED205.3(GND) LED206.3(GND) MH201.1 MH202.1 MH203.1 MH204.1 MH205.1 MH206.1 MH207.1 MH208.1 R113.2 R116.1 SW101.1(A) SW101.2(B) SW102.1(A) SW102.2(B) U101.19(TESTEN) U101.57(GND) U102.2(GND) U102.4(GND) U103.4(GND) U104.3(GND) Y101.2(GND) Y101.4(GND)
COL0: J201.1 J203.1 J205.1 R108.2
COL0_R: R108.1 U101.2(GPIO0)
COL1: J202.1 J204.1 J206.1 R110.2
COL1_R: R110.1 U101.3(GPIO1)
COL2: ENC201.1 R112.2
COL2_R: R112.1 U101.4(GPIO2)
CONN_USB_N: D101.1 J101.5(DN2) J101.7(DN1) R109.1
CONN_USB_P: D104.2 J101.6(DP1) J101.8(DP2) R111.1
ENC1_A: C203.2 R205.1 U101.18(GPIO15)
ENC1_B: C205.2 R207.1 U101.27(GPIO16)
ENC1_SW: D210.2 ENC201.2
LED0_BUF: R118.2 U104.1(NC) U104.2(A)
LED0_DIN: LED201.4(DIN) U104.4(Y)
LED0_RES: R118.1 U101.36(GPIO24)
LED1_DIN: LED201.2(DOUT) LED202.4(DIN)
LED2_DIN: LED202.2(DOUT) LED203.4(DIN)
LED3_DIN: LED203.2(DOUT) LED204.4(DIN)
LED4_DIN: LED204.2(DOUT) LED205.4(DIN)
LED5_DIN: LED205.2(DOUT) LED206.4(DIN)
QSPI_SCLK: U101.52(QSPI_SCLK) U103.6(CLK)
QSPI_SD0: U101.53(QSPI_SD0) U103.5(DI)
QSPI_SD1: U101.55(QSPI_SD1) U103.2(DO)
QSPI_SD2: U101.54(QSPI_SD2) U103.3(IO2)
QSPI_SD3: U101.51(QSPI_SD3) U103.7(IO3)
QSPI_SS: R124.2 U101.56(QSPI_SS) U103.1(CS#)
RESET_N: C126.2 R125.2 U101.26(RUN)
ROW0: D201.1 D202.1 D210.1 R114.2
ROW0_R: C117.2 R114.1 U101.11(GPIO8)
ROW1: D203.1 D204.1 R115.2
ROW1_R: C118.2 R115.1 U101.12(GPIO9)
ROW2: D205.1 D206.1 R117.2
ROW2_R: C121.2 R117.1 U101.13(GPIO10)
SWCLK: J102.1 U101.24(SWCLK)
SWDIO: J102.3 U101.25(SWD)
USB_N: R109.2 U101.46(USB_DM)
USB_P: R111.2 U101.47(USB_DP)
USER_LED1: R102.2 U101.37(GPIO25)
USER_LED2_B: R105.2 U101.40(GPIO28_ADC2)
USER_LED2_G: R104.2 U101.39(GPIO27_ADC1)
USER_LED2_R: R103.2 U101.38(GPIO26_ADC0)
X_R: C124.1 R121.1 Y101.3
XIN: C123.1 R120.2 U101.20(XIN) Y101.1
XOUT: R120.1 R121.2 U101.21(XOUT)
$2N5165: J101.10(CC2) R116.2
$2N5312: J101.4(CC1) R113.1
$2N7553: R122.1 R124.1 SW101.3(C) SW101.4(D)
$2N9130: R123.1 R125.1 SW102.3(C) SW102.4(D)
$2N9506: LED103.1(+) R102.1
$2N9799: LED102.1(A) R101.1
$2N17924: LED101.2(-) R103.1
$2N17928: LED101.3(-) R104.1
$2N17934: LED101.4(-) R105.1
$3N790: D201.2 J201.2
$3N2565: D202.2 J202.2
$3N2675: D203.2 J203.2
$3N3001: D204.2 J204.2
$3N3003: D205.2 J205.2
$3N3005: D206.2 J206.2
$3N3982: ENC201.A R201.1 R205.2
$3N4003: ENC201.B R202.1 R207.2

Not connected (* = marked no-connect by the designer): J101 3(SBU2)* 9(SBU1)*; LED206 2(DOUT)*; U101 5(GPIO3)* 6(GPIO4)* 7(GPIO5)* 8(GPIO6)* 9(GPIO7)* 14(GPIO11)* 15(GPIO12)* 16(GPIO13)* 17(GPIO14)* 28(GPIO17)* 29(GPIO18)* 30(GPIO19)* 31(GPIO20)* 32(GPIO21)* 34(GPIO22)* 35(GPIO23)* 41(GPIO29_ADC3)*

## Notes on the sheets
sheet 1
- Business Card Macro Pad (Page 1/2)
- Power LED
- User LED
- User RGB LED
- MCU
- Power for LEDs
- 5V to 3V3
- NOTE: COL3
- USB Connector
- NOTE: COL4
- NOTE: COL5
- NOTE: COL6
- NOTE: COL7
- Filter (Optional)
- NOTE: ROW3
- NF
- NOTE: ROW4
- NOTE: ROW5
- NOTE: ROW6
- NOTE: ENC2_A
- NF
- NOTE: ENC2_B
- NOTE: ENC3_A
- NOTE: ENC3_B
- NOTE: ENC4_A
- NOTE: ENC4_B
- NOTE: MOTOR
- NF
- NOTE: ENC5_A
- NOTE: ENC5_B
- NOTE: ENC6_A
- Debug Header
- NOTE: ENC6_B
- Design note: Filter is used for testing and debugging.
  If needed, replace 0Ω and fit correct C
- NF
- NF
- FLASH
- BOOT Select Button
- Reset Button
- NF
- Logic Level Shifter
sheet 2
- Business Card Macro Pad (Page 2/2)
- KEYS
- ENCODER 1
- MOUNTING HOLES
- METAL PLATE HOLDERS
- KEY LEDS
